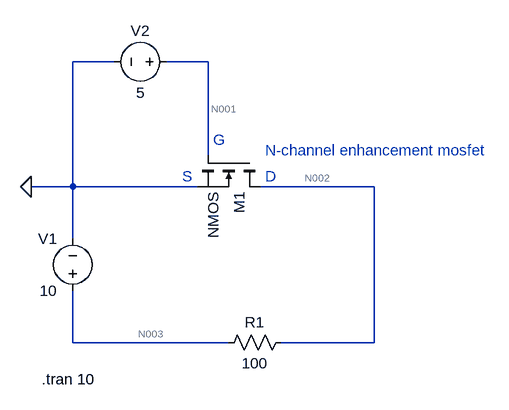
[diagram p0: schematic LogicTransistors.asc]
LogicTransistors.asc, the LTspice schematic file:
Version 4.1
SHEET 1 932 912
WIRE -16 304 -80 304
WIRE 128 304 64 304
WIRE 128 448 128 304
WIRE -80 496 -80 304
WIRE -80 496 -144 496
WIRE 112 496 -80 496
WIRE 384 496 208 496
WIRE -80 576 -80 496
WIRE -80 736 -80 656
WIRE 160 736 -80 736
WIRE 384 736 384 496
WIRE 384 736 240 736
FLAG -144 496 0
SYMBOL nmos 208 448 R90
SYMATTR InstName M1
SYMBOL voltage -80 672 R180
WINDOW 0 24 96 Left 2
WINDOW 3 24 16 Left 2
WINDOW 123 0 0 Left 0
WINDOW 39 0 0 Left 0
SYMATTR InstName V1
SYMATTR Value 10
SYMBOL res 256 720 R90
WINDOW 0 0 56 VBottom 2
WINDOW 3 32 56 VTop 2
SYMATTR InstName R1
SYMATTR Value 100
SYMBOL voltage 80 304 M270
WINDOW 0 32 56 VTop 2
WINDOW 3 -32 56 VBottom 2
WINDOW 123 0 0 Left 0
WINDOW 39 0 0 Left 0
SYMATTR InstName V2
SYMATTR Value 5
TEXT -128 792 Left 2 !.tran 10
TEXT 136 424 Left 2 ;G
TEXT 216 480 Left 2 ;D
TEXT 88 480 Left 2 ;S
TEXT 216 440 Left 2 ;N-channel enhancement mosfet

The netlist it stands for:
* LogicTransistors.asc
M1 N002 N001 0 0 NMOS
V1 N003 0 10
R1 N002 N003 100
V2 N001 0 5
.model NMOS NMOS
.model PMOS PMOS
.lib standard.mos
.tran 10
* G
* D
* S
* N-channel enhancement mosfet
.backanno
.end

* Results of the author's LTspice run, read from the files saved beside the schematic
* Operating Point, zero values left out:
*   V(n001) = 5 V
*   V(n002) = 9.975 V
*   V(n003) = 10 V
*   I(R1) = -250 µA
*   I(V1) = -250 µA
*   Ib(M1) = -9.985 pA
*   Id(M1) = 250 µA
*   Is(M1) = -250 µA